# EAGLE schematic newbutton (EAGLE 9.3.0)
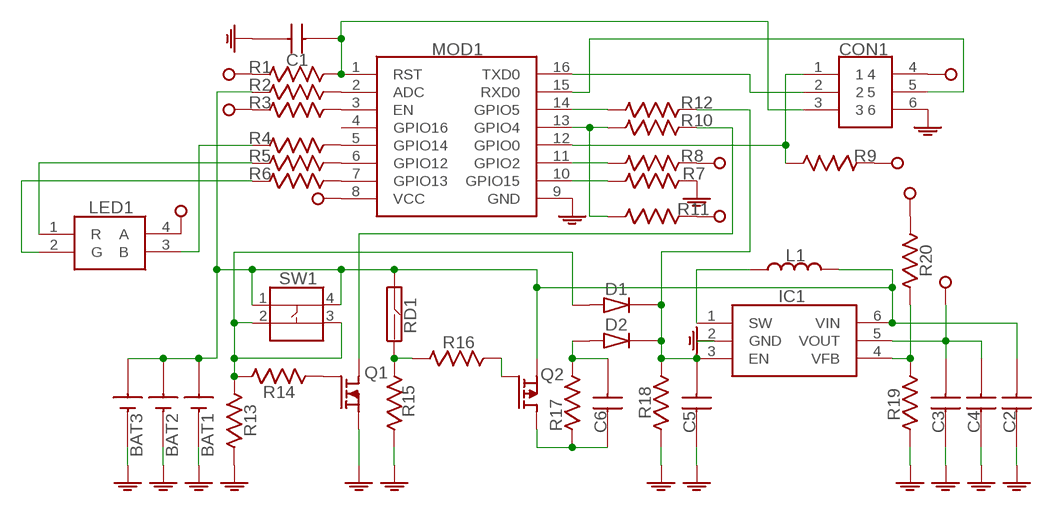
[diagram p0: schematic, sheet 1]

## Parts
BAT1  AAA-CONTACTS  [AAA-CONTACTS]
BAT2  AAA-CONTACTS  [AAA-CONTACTS]
BAT3  AAA-CONTACTS  [AAA-CONTACTS]
C1  CAPACITOR-0603  [0603]
C2  CAPACITOR-0805  [0805]
C3  CAPACITOR-0805  [0805]
C4  CAPACITOR-0603  [0603]
C5  CAPACITOR-0603  [0603]
C6  CAPACITOR-0603  [0603]
CON1  HEADER-6P-2R-DIP-2_54MM  [HEADER-6P-2R-DIP-2_54MM]
D1  DIODE-0603  [0603-DIODE]
D2  DIODE-0603  [0603-DIODE]
IC1  MCP1640  [SOT23-6]
L1  INDUCTOR-0520-0630  [INDUCTOR-0520-0630]
LED1  LED-RGB-3528-PLCC4  [LED-RGB-3528-PLCC4]
MOD1  ESP-12S  [ESP-12S]
Q1  N-MOSFET  [SOT23-3]
Q2  P-MOSFET  [SOT23-3]
R1  RESISTOR-0603  [0603]
R2  RESISTOR-0603  [0603]
R3  RESISTOR-0603  [0603]
R4  RESISTOR-0603  [0603]
R5  RESISTOR-0603  [0603]
R6  RESISTOR-0603  [0603]
R7  RESISTOR-0603  [0603]
R8  RESISTOR-0603  [0603]
R9  RESISTOR-0603  [0603]
R10  RESISTOR-0603  [0603]
R11  RESISTOR-0603  [0603]
R12  RESISTOR-0603  [0603]
R13  RESISTOR-0603  [0603]
R14  RESISTOR-0603  [0603]
R15  RESISTOR-0603  [0603]
R16  RESISTOR-0603  [0603]
R17  RESISTOR-0603  [0603]
R18  RESISTOR-0603  [0603]
R19  RESISTOR-0603  [0603]
R20  RESISTOR-0603  [0603]
RD1  REED-DIP  [REED-DIP]
SW1  BUTTON-4P-SMD-5X5  [BUTTON-4P-SMD-5X5]

## Nets
GND: BAT1.2(-) BAT1.4(-) BAT2.2(-) BAT2.4(-) BAT3.2(-) BAT3.4(-) C1.1 C2.1 C3.1 C4.1 C5.1 CON1.6 IC1.2(GND) MOD1.9(GND) Q1.2(S) R7.2 R13.1 R15.1 R18.1 R19.1
N$1: IC1.1(SW) L1.1
N$2: MOD1.2(ADC) R2.2
N$3: MOD1.3(EN) R3.2
N$4: MOD1.5(GPIO14) R4.2
N$5: MOD1.6(GPIO12) R5.2
N$6: MOD1.7(GPIO13) R6.2
N$7: MOD1.10(GPIO15) R7.1
N$8: MOD1.11(GPIO2) R8.1
N$9: MOD1.13(GPIO4) R10.1 R11.1
N$10: MOD1.14(GPIO5) R12.1
N$11: C5.2 D1.2(K) D2.2(K) IC1.3(EN) R12.2 R18.2
N$12: Q1.3(D) R10.2
N$13: CON1.5 MOD1.15(RXD0)
N$14: CON1.1 MOD1.12(GPIO0) R9.2
N$15: C1.2 CON1.3 MOD1.1(RST) R1.2
N$16: CON1.2 MOD1.16(TXD0)
N$18: LED1.3(B) R4.1
N$19: LED1.1(R) R5.1
N$20: LED1.2(G) R6.1
N$21: D1.1(A) R13.2 R14.1 SW1.2 SW1.3
N$23: R15.2 R16.1 RD1.P$2
N$24: Q2.1(G) R16.2
N$25: C6.1 Q2.3(D) R17.1
N$26: C6.2 D2.1(A) R17.2
N$27: IC1.4(VFB) R19.2 R20.1
N$28: Q1.1(G) R14.2
N$29: BAT1.1(+) BAT1.3(+) BAT2.1(+) BAT2.3(+) BAT3.1(+) BAT3.3(+) C2.2 IC1.6(VIN) L1.2 Q2.2(S) R2.1 RD1.P$1 SW1.1 SW1.4
VCC: C3.2 C4.2 CON1.4 IC1.5(VOUT) LED1.4(A) MOD1.8(VCC) R1.1 R3.1 R8.2 R9.1 R11.2 R20.2
Unconnected: MOD1.4(GPIO16)

## Library data of the parts
BAT1-BAT3 = SamacSys_Parts:AAA-CONTACTS
C1 C4-C6 = SamacSys_Parts:CAPACITOR-0603
C2 C3 = SamacSys_Parts:CAPACITOR-0805
CON1 = SamacSys_Parts:HEADER-6P-2R-DIP-2_54MM
D1 D2 = SamacSys_Parts:DIODE-0603
IC1 = SamacSys_Parts:MCP1640
L1 = SamacSys_Parts:INDUCTOR-0520-0630
LED1 = SamacSys_Parts:LED-RGB-3528-PLCC4
MOD1 = SamacSys_Parts:ESP-12S
Q1 = SamacSys_Parts:N-MOSFET
Q2 = SamacSys_Parts:P-MOSFET
R1-R20 = SamacSys_Parts:RESISTOR-0603
RD1 = SamacSys_Parts:REED-DIP
SW1 = SamacSys_Parts:BUTTON-4P-SMD-5X5

## Net classes
0 default: width 0.381 mm, drill 0.381 mm, clearance 0.254 mm